# EAGLE design Keyboard02 (EAGLE 5.00)
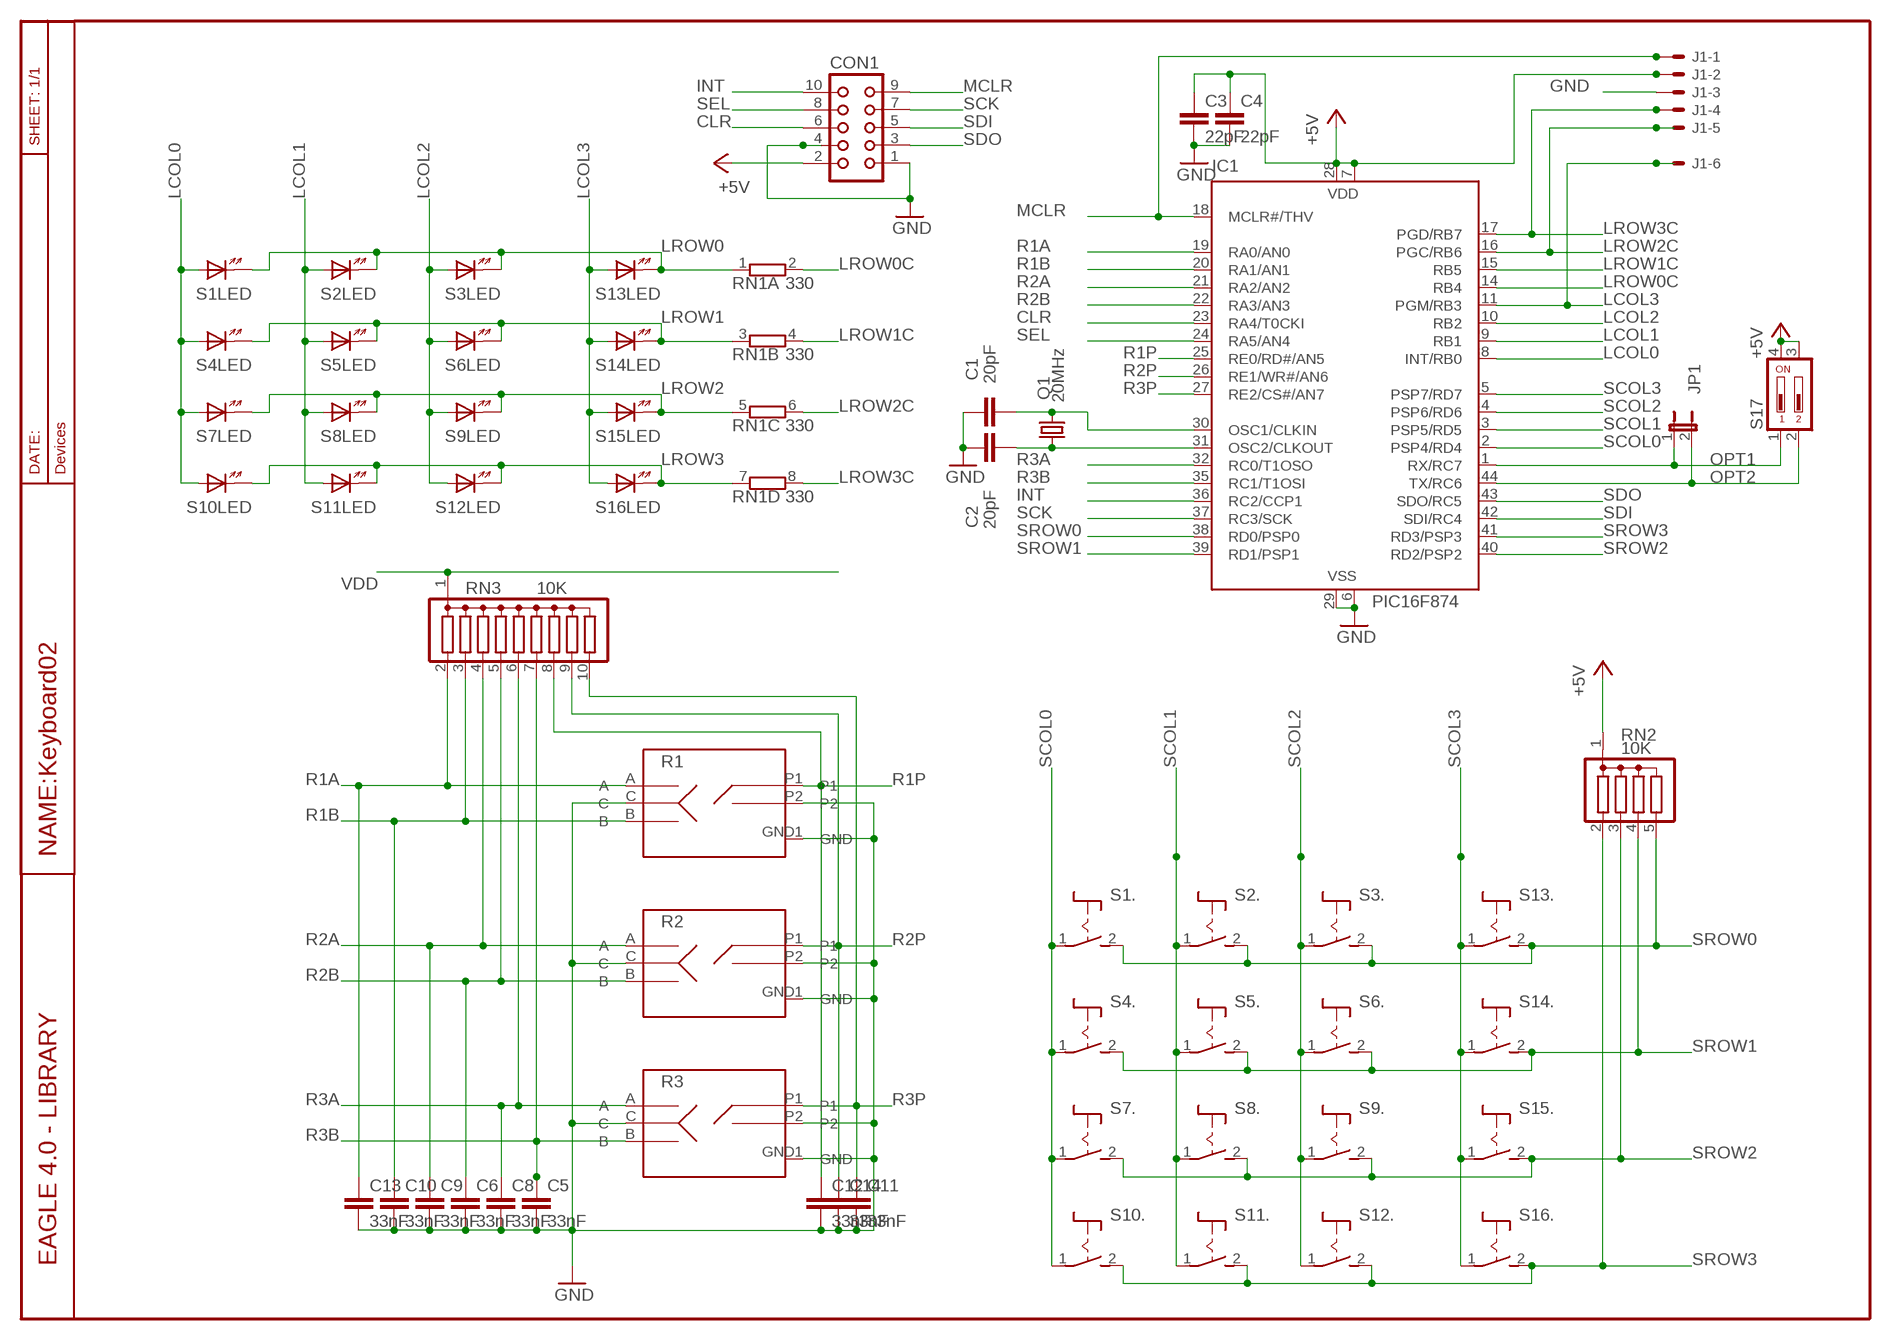
[diagram p0: schematic, sheet 1]

## Parts
C1  20pF  C-EUC0805K  [C0805K]
C2  20pF  C-EUC0805K  [C0805K]
C3  22pF  C-EUC0805K  [C0805K]
C4  22pF  C-EUC0805K  [C0805K]
C5  33nF  C-EUC0805K  [C0805K]
C6  33nF  C-EUC0805K  [C0805K]
C8  33nF  C-EUC0805K  [C0805K]
C9  33nF  C-EUC0805K  [C0805K]
C10  33nF  C-EUC0805K  [C0805K]
C11  33nF  C-EUC0805K  [C0805K]
C12  33nF  C-EUC0805K  [C0805K]
C13  33nF  C-EUC0805K  [C0805K]
C14  33nF  C-EUC0805K  [C0805K]
CON1  CON10L  [CON10L]
IC1  PIC16F874  PIC16F874PQ  [MQFP44-2]
J1  22-27-2061-06  [6410-06]
JP1  JP1E  [JP1]
Q1  20MHz  CRYTALMM20SS  [MM20SS]
R1  DDM_427  [DDM427]
R2  DDM_427  [DDM427]
R3  DDM_427  [DDM427]
RN1  330  E5R  [SIL10]
RN2  10K  G04R  [SIL5]
RN3  10K  G09R  [SIL10]
S1  MARQ6425BS  [MARQ6425-BS]
S2  MARQ6425BS  [MARQ6425-BS]
S3  MARQ6425BS  [MARQ6425-BS]
S4  MARQ6425BS  [MARQ6425-BS]
S5  MARQ6425BS  [MARQ6425-BS]
S6  MARQ6425BS  [MARQ6425-BS]
S7  MARQ6425BS  [MARQ6425-BS]
S8  MARQ6425BS  [MARQ6425-BS]
S9  MARQ6425BS  [MARQ6425-BS]
S10  MARQ6425BS  [MARQ6425-BS]
S11  MARQ6425BS  [MARQ6425-BS]
S12  MARQ6425BS  [MARQ6425-BS]
S13  MARQ6425BS  [MARQ6425-BS]
S14  MARQ6425BS  [MARQ6425-BS]
S15  MARQ6425BS  [MARQ6425-BS]
S16  MARQ6425BS  [MARQ6425-BS]
S17  DA02  [DA-02]

## Nets
CLR: CON1.6 IC1.23(RA4/T0CKI)
GND [SUPPLY]: C1.1 C2.1 C3.2 C4.2 C5.2 C6.2 C8.2 C9.2 C10.2 C11.2 C12.2 C13.2 C14.2 CON1.1 CON1.4 IC1.6(VSS) IC1.29(VSS) J1.3 R1.C R1.GND1(GND) R1.P2 R2.C R2.GND1(GND) R2.P2 R3.C R3.GND1(GND) R3.P2
INT: CON1.10 IC1.36(RC2/CCP1)
LCOL0: IC1.8(INT/RB0) S1.A(LED:A) S4.A(LED:A) S7.A(LED:A) S10.A(LED:A)
LCOL1: IC1.9(RB1) S2.A(LED:A) S5.A(LED:A) S8.A(LED:A) S11.A(LED:A)
LCOL2: IC1.10(RB2) S3.A(LED:A) S6.A(LED:A) S9.A(LED:A) S12.A(LED:A)
LCOL3: IC1.11(PGM/RB3) J1.6 S13.A(LED:A) S14.A(LED:A) S15.A(LED:A) S16.A(LED:A)
LROW0: RN1.1 S1.K(LED:K) S2.K(LED:K) S3.K(LED:K) S13.K(LED:K)
LROW0C: IC1.14(RB4) RN1.2
LROW1: RN1.3 S4.K(LED:K) S5.K(LED:K) S6.K(LED:K) S14.K(LED:K)
LROW1C: IC1.15(RB5) RN1.4
LROW2: RN1.5 S7.K(LED:K) S8.K(LED:K) S9.K(LED:K) S15.K(LED:K)
LROW2C: IC1.16(PGC/RB6) J1.5 RN1.6
LROW3: RN1.7 S10.K(LED:K) S11.K(LED:K) S12.K(LED:K) S16.K(LED:K)
LROW3C: IC1.17(PGD/RB7) J1.4 RN1.8
MCLR: CON1.9 IC1.18(MCLR#/THV) J1.1
OPT1: IC1.1(RX/RC7) JP1.1 S17.1
OPT2: IC1.44(TX/RC6) JP1.2 S17.2
OSC1: C1.2 IC1.30(OSC1/CLKIN) Q1.1
OSC2: C2.2 IC1.31(OSC2/CLKOUT) Q1.4
R1A: C13.1 IC1.19(RA0/AN0) R1.A RN3.2
R1B: C10.1 IC1.20(RA1/AN1) R1.B RN3.3
R1P: C12.1 IC1.25(RE0/RD#/AN5) R1.P1 RN3.8
R2A: C9.1 IC1.21(RA2/AN2) R2.A RN3.4
R2B: C6.1 IC1.22(RA3/AN3) R2.B RN3.5
R2P: C14.1 IC1.26(RE1/WR#/AN6) R2.P1 RN3.9
R3A: C8.1 IC1.32(RC0/T1OSO) R3.A RN3.6
R3B: C5.1 IC1.35(RC1/T1OSI) R3.B RN3.7
R3P: C11.1 IC1.27(RE2/CS#/AN7) R3.P1 RN3.10
SCK: CON1.7 IC1.37(RC3/SCK)
SCOL0: IC1.2(PSP4/RD4) S1.1(.:P) S4.1(.:P) S7.1(.:P) S10.1(.:P)
SCOL1: IC1.3(PSP5/RD5) S2.1(.:P) S5.1(.:P) S8.1(.:P) S11.1(.:P)
SCOL2: IC1.4(PSP6/RD6) S3.1(.:P) S6.1(.:P) S9.1(.:P) S12.1(.:P)
SCOL3: IC1.5(PSP7/RD7) S13.1(.:P) S14.1(.:P) S15.1(.:P) S16.1(.:P)
SDI: CON1.5 IC1.42(SDI/RC4)
SDO: CON1.3 IC1.43(SDO/RC5)
SEL: CON1.8 IC1.24(RA5/AN4)
SROW0: IC1.38(RD0/PSP0) RN2.5 S1.2(.:S) S2.2(.:S) S3.2(.:S) S13.2(.:S)
SROW1: IC1.39(RD1/PSP1) RN2.4 S4.2(.:S) S5.2(.:S) S6.2(.:S) S14.2(.:S)
SROW2: IC1.40(RD2/PSP2) RN2.3 S7.2(.:S) S8.2(.:S) S9.2(.:S) S15.2(.:S)
SROW3: IC1.41(RD3/PSP3) RN2.2 S10.2(.:S) S11.2(.:S) S12.2(.:S) S16.2(.:S)
VDD [SUPPLY]: C3.1 C4.1 CON1.2 IC1.7(VDD) IC1.28(VDD) J1.2 RN2.1 RN3.1 S17.3 S17.4 ; supply symbol labelled +5V
Unconnected: RN1.9 RN1.10

## Library data of the parts
C1-C6 C8-C14 = rcl:C-EU: CAPACITOR, European symbol
CON1 = con-harting:CON10L: CONNECTOR
IC1 = microchip:PIC16F87*: MICROCONTROLLER
J1 = ep_molex_6410_7395-02:22-?-06: CONNECTOR wire to board 2.54 mm (.1 inch) pitch header
JP1 = jumper:JP1E: JUMPER
Q1 = crystal:CRYTAL: CRYSTAL
R1-R3 = turbod3:DDM_427
RN1 = resistor-sil:E5R: SIL RESISTOR
RN2 = resistor-sil:G04R: SIL RESISTOR
RN3 = resistor-sil:G09R: SIL RESISTOR
S1-S16 = switch:MARQ6425: DIL SWITCH with LED, Marquardt
S17 = switch-dil:DA02: DIL/CODE SWITCH

## Net classes
0 default: width 0.254 mm, clearance 0.254 mm
1 SUPPLY: width 0.356 mm, clearance 0.254 mm

## Board
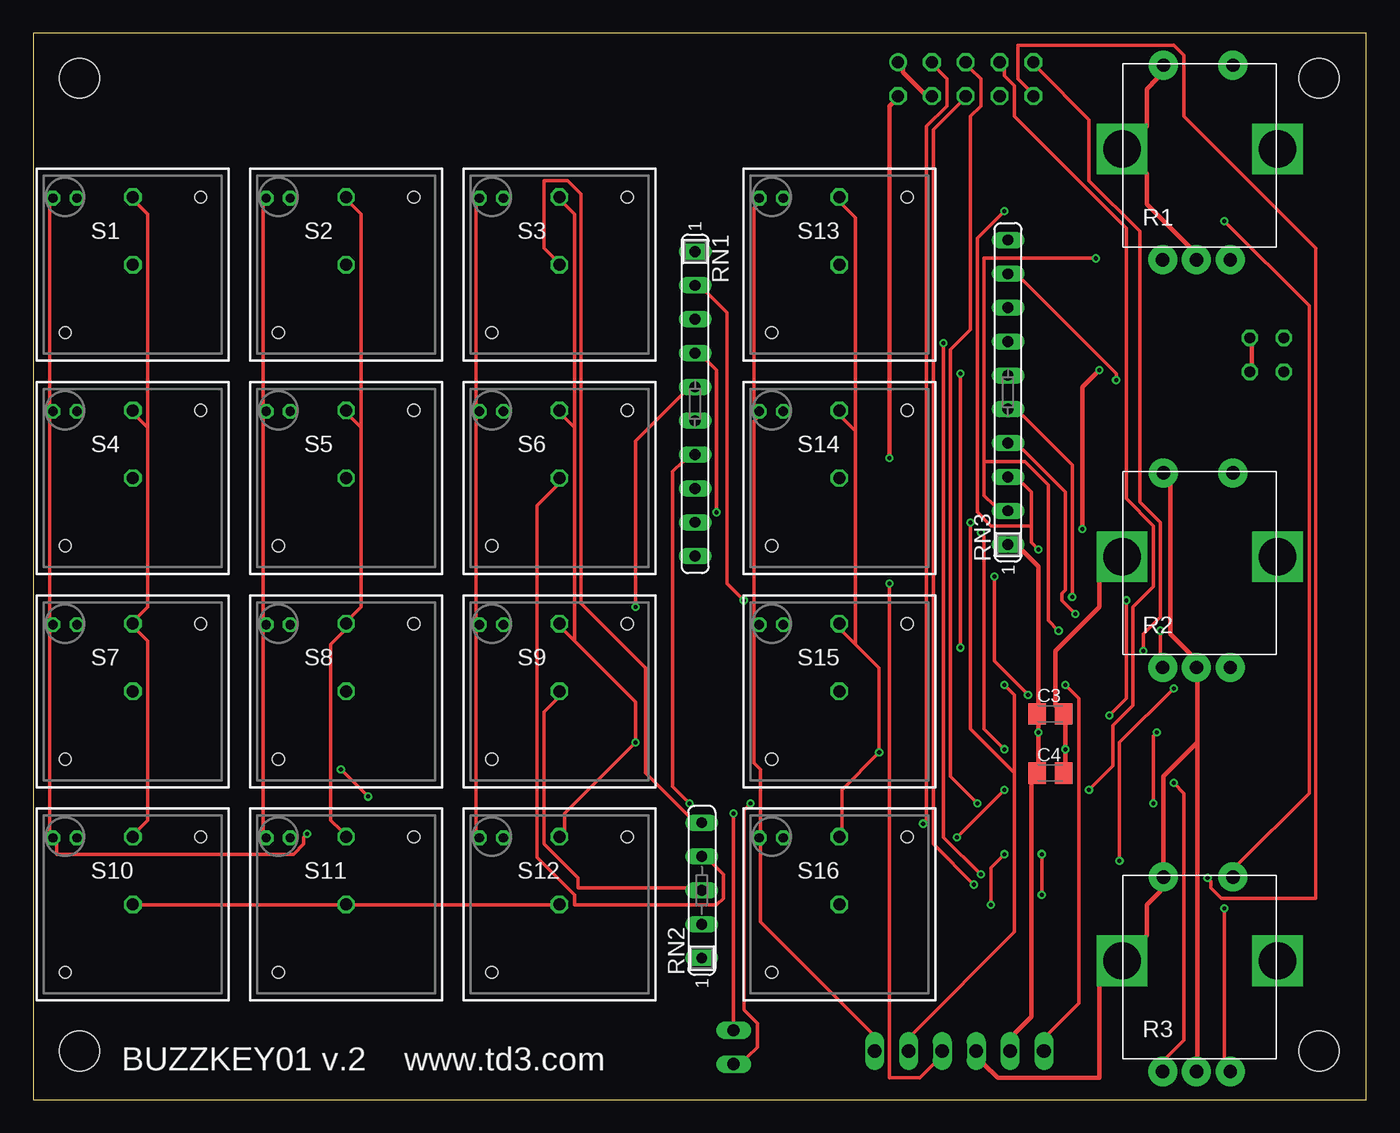
[diagram p1: board, top side]
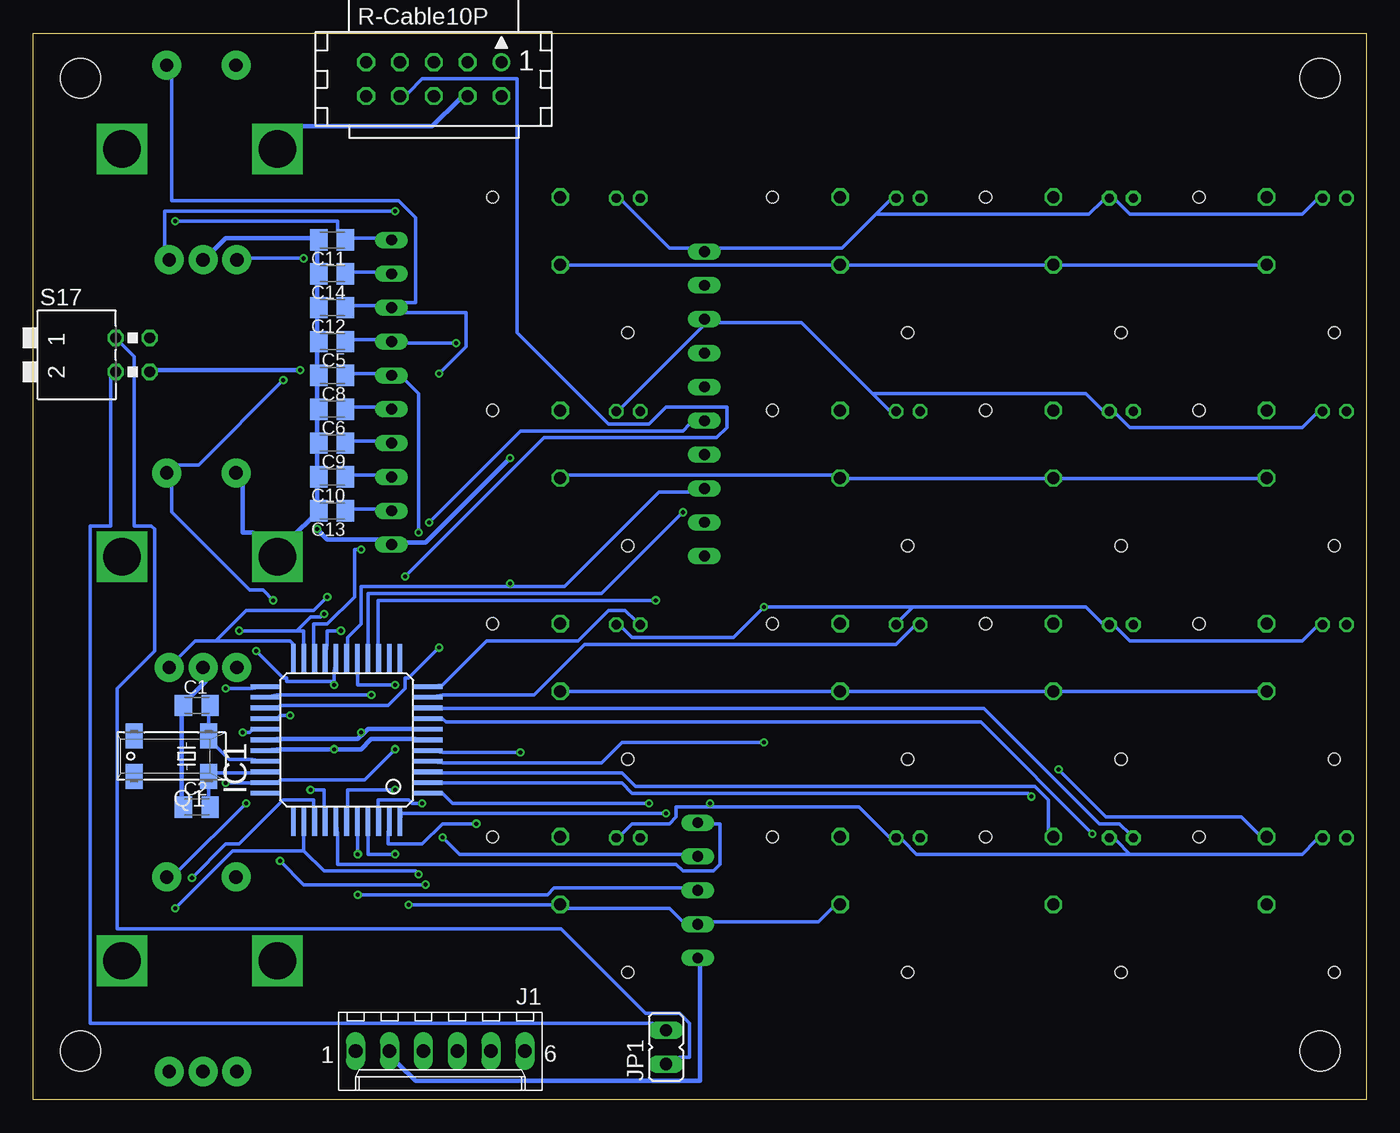
[diagram p2: board, bottom side, seen from below]

Size 100 x 80 mm. Coordinates in mm from the lower left corner, seen from the top.
Outline: 0,0 100,0 100,80 0,80 0,0
Copper layers (1*16): Top 0.035mm / dielectric 1.5mm / Bottom 0.035mm
Design rules "leiton": minimum track width 6mil, minimum drill 12mil, track to track 6mil, track to pad 6mil, pad to pad 6mil, via to via 6mil, smd to smd 6mil, copper to edge 20mil, drill to drill 8mil, minimum pad ring 8mil, minimum via ring 6mil, stop-mask expansion 3mil, vias tented up to drill 0mil, thermal gap 8mil
Holes 3 mm at 3.47,3.63 96.47,76.63 3.47,76.63 96.47,3.63

### Footprints (pad centres in the part's own frame; a part is rotated, then mirrored left to right if it is on the bottom)
C0805K = smd 1.3 x 1.6: 1 -1,0; 2 1,0
CON10L = drill 0.914 round: 1 5.08,1.27 | drill 0.914 octagon: 2 5.08,-1.27; 3 2.54,1.27; 4 2.54,-1.27; 5 0,1.27; 6 0,-1.27; 7 -2.54,1.27; 8 -2.54,-1.27; 9 -5.08,1.27; 10 -5.08,-1.27
MQFP44-2 = smd 0.35 x 2.2: 1 -4,-6.1; 2 -3.2,-6.1; 3 -2.4,-6.1; 4 -1.6,-6.1; 5 -0.8,-6.1; 6 0,-6.1; 7 0.8,-6.1; 8 1.6,-6.1; 9 2.4,-6.1; 10 3.2,-6.1; 11 4,-6.1; 23 4,6.1; 24 3.2,6.1; 25 2.4,6.1; 26 1.6,6.1; 27 0.8,6.1; 28 0,6.1; 29 -0.8,6.1; 30 -1.6,6.1; 31 -2.4,6.1; 32 -3.2,6.1; 33 -4,6.1 | smd 2.2 x 0.35: 12 6.1,-4; 13 6.1,-3.2; 14 6.1,-2.4; 15 6.1,-1.6; 16 6.1,-0.8; 17 6.1,0; 18 6.1,0.8; 19 6.1,1.6; 20 6.1,2.4; 21 6.1,3.2; 22 6.1,4; 34 -6.1,4; 35 -6.1,3.2; 36 -6.1,2.4; 37 -6.1,1.6; 38 -6.1,0.8; 39 -6.1,0; 40 -6.1,-0.8; 41 -6.1,-1.6; 42 -6.1,-2.4; 43 -6.1,-3.2; 44 -6.1,-4
6410-06 = drill 1.016 long: 1 6.35,0; 2 3.81,0; 3 1.27,0; 4 -1.27,0; 5 -3.81,0; 6 -6.35,0
JP1 = drill 0.914 long: 1 0,-1.27; 2 0,1.27
MM20SS = smd 1.27 x 1.88: 1 -2.794,-1.524; 2 2.794,-1.524; 3 2.794,1.524; 4 -2.794,1.524
DDM427 = drill 1 pad 2.184 round: A 2.98,-0.96; B 8.06,-0.96; C 5.52,-0.96; P1 8.25,13.64; P2 3.04,13.64 | drill 2.8 pad 3.81 square: GND1 -0.06,7.35; GND2 11.6,7.35
SIL10 = drill 0.813 long: 1 -11.43,0; 2 -8.89,0; 3 -6.35,0; 4 -3.81,0; 5 -1.27,0; 6 1.27,0; 7 3.81,0; 8 6.35,0; 9 8.89,0; 10 11.43,0
SIL5 = drill 0.813 long: 1 -5.08,0; 2 -2.54,0; 3 0,0; 4 2.54,0; 5 5.08,0
MARQ6425-BS = drill 0.9 octagon: 1 0,5.08; 2 0,0 | drill 0.7 octagon: A -6,5; K -4.2,5 | hole 0.9: 5.08,5.08; -5.08,-5.08
DA-02 = drill 0.813 octagon: 1 -1.27,-1.27; 2 1.27,-1.27; 3 1.27,1.27; 4 -1.27,1.27

### Placement (x,y rotation side)
C1  87.73,29.57 0 bottom
C2  87.73,21.95 0 bottom
C3  76.3,28.93 0 top
C4  76.3,24.49 0 top
C5  77.58,56.88 180 bottom
C6  77.58,51.8 180 bottom
C8  77.58,54.34 180 bottom
C9  77.58,49.26 180 bottom
C10  77.58,46.72 180 bottom
C11  77.58,64.5 180 bottom
C12  77.58,59.41 180 bottom
C13  77.58,44.18 180 bottom
C14  77.58,61.96 180 bottom
CON1  69.95,76.56 0 bottom
IC1  76.5,26.98 90 bottom
J1  69.47,3.63 180 bottom
JP1  52.54,3.93 0 bottom
Q1  89.64,25.76 180 bottom
R1  81.75,63.97 0 top
R2  81.75,33.38 0 top
R3  81.75,3.06 0 top
RN1  49.66,52.2 270 top
RN2  50.16,15.7 90 top
RN3  73.13,53.07 90 top
S1  7.47,62.63 0 top
S2  23.47,62.63 0 top
S3  39.47,62.63 0 top
S4  7.47,46.63 0 top
S5  23.47,46.63 0 top
S6  39.47,46.63 0 top
S7  7.47,30.63 0 top
S8  23.47,30.63 0 top
S9  39.47,30.63 0 top
S10  7.47,14.63 0 top
S11  23.47,14.63 0 top
S12  39.47,14.63 0 top
S13  60.47,62.63 0 top
S14  60.47,46.63 0 top
S15  60.47,30.63 0 top
S16  60.47,14.63 0 top
S17  92.55,55.88 270 bottom

### Tracks (layer width: path | path; a pad name or v marks a point on that pad's centre or on a via)
CLR  (via drill 0.3)
  Top 0.254: v85.56,30.86 81.5,26.79 v81.5,17.9 | v70.57,16.12 67.53,19.17 67.53,72.77 69.56,74.8 CON1.6
  Bottom 0.254: v85.56,30.86 83.53,30.86 IC1.23 | v81.5,17.9 79.72,16.12 v70.57,16.12
GND  (via drill 0.3)
  Top 0.356: J1.3 71.34,2.66 72.35,1.65 79.97,1.65 79.97,8.76 R3.GND1 83.53,12.31 83.53,14.6 84.54,15.62 R3.P2 84.8,17.65 84.8,24.25 87.34,26.79 | 87.34,26.79 87.34,31.36 R2.C 86.83,33.4 85.31,34.92 85.31,46.1 R2.P2 | 87.34,26.79 87.34,3.17 R3.C | CON1.4 66.76,75.56 65.24,77.08 65.24,77.34 CON1.1 | R1.C 86.83,63.88 83.53,67.18 83.53,69.46 R1.GND1 83.53,73.02 83.53,75.81 84.29,76.58 R1.P2 | C4.2 77.43,25.27 v77.43,26.28 77.43,28.32 C3.2 76.67,29.59 76.67,33.65 79.97,36.95 79.97,38.98 R2.GND1
  Bottom 0.356: C2.1 88.86,22.73 88.86,28.82 C1.1 88.1,30.35 87.08,31.36 R2.C | CON1.4 68.03,75.05 70.07,73.02 79.97,73.02 R1.GND1 | IC1.6 71.34,27.05 74.64,27.05 75.4,26.28 v77.43,26.28 81.75,26.28 IC1.29 | R2.P2 84.29,46.1 84.29,42.54 83.53,42.54 R2.GND1 80.23,42.54 79.21,43.56 C13.2 78.7,44.83 78.7,46.1 C10.2 78.7,47.37 78.7,48.64 C9.2 78.7,49.91 78.7,51.18 C6.2 78.7,52.45 78.7,53.72 C8.2 78.7,54.99 78.7,56.26 C5.2 78.7,57.53 78.7,58.8 C12.2 78.7,60.07 78.7,61.34 C14.2 78.7,62.61 78.7,63.88 C11.2 79.21,64.64 85.56,64.64 86.58,63.62 R1.C
INT  (via drill 0.3)
  Top 0.254: v88.1,16.63 88.35,16.38 88.35,15.87 89.12,15.11 96.23,15.11 96.23,63.88 86.32,73.78 86.32,78.35 85.56,79.12 73.88,79.12 73.88,76.58 74.64,75.81 CON1.10
  Bottom 0.254: v88.1,16.63 85.56,19.17 84.54,19.17 81.24,22.47 78.96,22.47 78.96,21.97 IC1.36
LCOL0  (via drill 0.3)
  Top 0.254: S1.A 1.23,67.18 1.23,51.94 S4.A 1.23,51.18 1.23,35.94 S7.A 1.23,35.17 1.23,19.93 S10.A 1.74,19.17 1.74,18.41 19.52,18.41 20.28,19.17 20.28,19.68 v20.54,19.93
  Bottom 0.254: v20.54,19.93 28.92,28.32 69.05,28.32 69.3,28.57 IC1.8
LCOL1
  Top 0.254: S2.A 17.23,67.18 17.23,51.94 S5.A 17.23,51.18 17.23,35.94 S8.A 17.23,35.17 17.23,19.93 S11.A
  Bottom 0.254: IC1.9 69.3,29.33 28.66,29.33 20.03,20.7 18.5,20.7 17.74,19.93 S11.A
LCOL2
  Top 0.254: S3.A 33.24,67.18 33.24,51.94 S6.A 33.24,51.18 33.24,35.94 S9.A 33.24,35.17 33.24,19.93 S12.A
  Bottom 0.254: IC1.10 69.3,30.35 62.45,30.35 58.64,34.16 35.27,34.16 34,35.43 S9.A
LCOL3
  Top 0.254: S13.A 54.32,67.18 54.06,66.92 54.06,51.94 S14.A 54.32,51.18 54.06,50.92 54.06,35.94 S15.A 54.06,35.43 54.06,25.27 54.57,24.76 54.57,19.93 S16.A 54.57,19.17 54.57,13.33 62.95,4.95 J1.6
  Bottom 0.254: IC1.11 69.3,31.11 66,34.41 59.14,34.41 56.86,36.7 55.59,36.7 54.83,35.94 S15.A
LROW0
  Bottom 0.254: S1.K 3.77,67.43 4.79,66.42 17.74,66.42 18.76,67.43 S2.K 19.77,67.43 20.79,66.42 36.79,66.42 | 36.79,66.42 39.33,63.88 48.48,63.88 RN1.1 50.76,63.88 52.29,63.88 55.84,67.43 S13.K | 36.79,66.42 35.78,67.43 S3.K
LROW0C  (via drill 0.3)
  Top 0.254: v53.3,37.46 52.03,38.73 52.03,59.05 50.51,60.57 RN1.2
  Bottom 0.254: v53.3,37.46 74.13,37.46 74.13,34.16 IC1.14
LROW1
  Bottom 0.254: S4.K 3.77,51.43 4.79,50.41 17.74,50.41 18.76,51.43 S5.K 19.77,51.68 21.04,52.95 37.05,52.95 | 37.05,52.95 42.38,58.29 48.48,58.29 RN1.3 49.75,58.03 55.84,51.94 S14.K | 37.05,52.95 35.78,51.68 S6.K
LROW1C  (via drill 0.3)
  Top 0.254: v51.27,44.06 51.27,54.73 50.51,55.49 RN1.4
  Bottom 0.254: v51.27,44.06 57.37,37.97 74.89,37.97 74.89,34.16 IC1.15
LROW2  (via drill 0.3)
  Top 0.254: v45.17,36.95 45.17,49.4 48.73,52.95 RN1.5
  Bottom 0.254: S7.K 3.77,35.43 4.79,34.41 17.74,34.41 18.76,35.43 S8.K 19.77,35.68 21.04,36.95 34,36.95 | 34,36.95 35.01,35.94 S9.K | 34,36.95 v45.17,36.95 47.46,34.67 55.08,34.67 55.84,35.43 S15.K
LROW2C  (via drill 0.3)
  Top 0.254: v72.86,31.11 73.62,30.35 73.62,24.51 | 73.62,24.51 73.62,12.57 66,4.95 J1.5 | v70.32,43.3 70.32,27.81 73.62,24.51
  Bottom 0.254: v72.86,31.11 75.65,31.11 75.65,32.13 IC1.16 | v70.32,43.3 63.46,50.16 51.27,50.16 50.76,50.67 RN1.6
LROW3  (via drill 0.3)
  Top 0.254: v49.24,22.22 47.97,23.49 47.97,47.11 48.73,47.87 RN1.7
  Bottom 0.254: 17.74,18.41 4.79,18.41 3.77,19.43 S10.K | 17.74,18.41 18.76,19.43 S11.K | 17.74,18.41 33.74,18.41 34.76,19.43 S12.K 35.78,19.68 38.06,21.97 49.24,21.97 | 49.24,21.97 51.78,21.97 51.78,21.2 52.29,20.7 55.08,20.7 55.84,19.93 S16.K | 49.24,21.97 v49.24,22.22
LROW3C  (via drill 0.3)
  Top 0.254: v64.22,38.73 64.22,1.65 66.51,1.65 67.53,2.66 J1.4
  Bottom 0.254: 64.22,38.48 60.16,38.48 53.05,45.59 50.76,45.59 RN1.8 | 64.22,38.48 75.4,38.48 75.4,35.68 76.42,34.67 76.42,34.16 IC1.17 | v64.22,38.73 64.22,38.48
MCLR  (via drill 0.3)
  Top 0.254: v77.43,31.11 78.45,30.09 78.45,7.23 76.16,4.95 J1.1 | v83.27,33.65 83.27,34.92 84.54,36.19 84.54,43.3 83.02,44.83 83.02,65.15 79.21,68.96 79.21,73.53 75.4,77.34 CON1.9
  Bottom 0.254: 77.43,31.36 77.43,32.13 IC1.18 | v83.27,33.65 81.24,31.62 80.99,31.62 80.99,31.36 77.43,31.36 | v77.43,31.11 77.43,31.36
OPT1  (via drill 0.3)
  Top 0.254: v53.81,22.22 53.3,21.71 53.3,6.73 54.32,5.71 54.32,3.93 53.56,3.17 JP1.1
  Bottom 0.254: v53.81,22.22 68.54,22.22 69.3,22.98 IC1.1 | S17.1 92.42,55.75 92.42,43.05 91.15,43.05 90.89,42.79 90.89,33.65 93.69,30.86 93.69,12.82 60.41,12.82 54.06,6.47 51.52,6.47 50.76,5.71 50.76,3.17 51.52,3.17 JP1.1
OPT2  (via drill 0.3)
  Top 0.254: JP1.2 v52.54,21.46
  Bottom 0.254: v52.54,21.46 72.35,21.46 IC1.44 | S17.2 94.2,54.22 94.2,43.05 95.72,43.05 95.72,5.71 53.56,5.71 JP1.2
OSC1
  Bottom 0.254: C1.2 86.83,28.82 86.83,28.06 Q1.1 86.32,26.54 85.31,25.52 83.53,25.52 IC1.30
OSC2
  Bottom 0.254: C2.2 86.83,22.73 86.83,23.49 Q1.4 86.32,24.51 83.53,24.51 IC1.31
R1A  (via drill 0.3)
  Top 0.254: v76.92,35.17 76.16,35.94 76.16,46.1 74.38,47.87 71.34,47.87 | 71.34,47.87 71.34,45.33 72.1,44.57 RN3.2 | v79.72,63.11 71.34,63.11 71.34,47.87
  Bottom 0.254: C13.1 76.16,44.32 74.13,44.32 RN3.2 | v76.92,35.17 77.94,35.17 77.94,34.16 IC1.19 | v79.72,63.11 83.78,63.11 R1.A
R1B  (via drill 0.3)
  Top 0.254: v75.4,41.27 74.89,41.78 74.89,43.05 | 74.89,43.05 74.89,45.59 74.13,46.35 RN3.3 | v72.86,66.67 70.83,64.64 70.83,44.06 71.84,43.05 74.89,43.05
  Bottom 0.254: C10.1 76.16,46.86 74.13,46.86 RN3.3 | v75.4,41.27 75.91,41.27 75.91,37.71 77.94,35.68 78.96,35.68 78.96,34.16 IC1.20 | v72.86,66.67 90.13,66.67 90.13,63.88 R1.B
R1P  (via drill 0.3)
  Top 0.254: v69.56,33.9 v69.56,54.48
  Bottom 0.254: C12.1 76.16,59.56 74.13,59.56 RN3.8 | v69.56,33.9 71.84,31.62 72.1,31.62 72.1,30.86 73.37,29.59 81.5,29.59 81.75,29.33 IC1.25 | v69.56,54.48 67.53,56.51 67.53,59.05 72.1,59.05 RN3.8 | R1.P1 89.62,76.58 89.62,67.43 72.61,67.43 71.34,66.16 71.34,59.81 72.1,59.81 RN3.8
R2A  (via drill 0.3)
  Top 0.254: v84.54,35.17 84.54,33.4 R2.A | v78.19,36.44 77.18,37.46 77.18,37.97 77.43,38.22 77.43,45.59 74.13,48.89 RN3.4
  Bottom 0.254: C9.1 76.16,49.4 74.13,49.4 RN3.4 | 80.23,35.17 v84.54,35.17 | 80.23,35.17 79.72,35.17 79.72,34.16 IC1.21 | v78.19,36.44 78.45,36.19 79.21,36.19 80.23,35.17
R2B  (via drill 0.3)
  Top 0.254: v77.94,37.71 77.94,47.62 74.13,51.43 RN3.5
  Bottom 0.254: C6.1 76.16,51.94 74.13,51.94 RN3.5 | 86.32,34.41 87.85,34.41 89.12,33.14 R2.B | 86.32,34.41 80.73,34.41 80.48,34.16 IC1.22 | v77.94,37.71 78.96,36.7 84.04,36.7 86.32,34.41
R2P  (via drill 0.3)
  Top 0.254: v80.73,28.82 82,30.09 v82,37.46 | v81.24,53.97 81.24,54.48 74.13,61.59 RN3.9
  Bottom 0.254: C14.1 76.16,62.1 74.13,62.1 RN3.9 | v80.73,28.82 81.5,28.82 81.75,28.57 IC1.26 | v82,37.46 82.77,38.22 83.78,38.22 89.62,44.06 89.62,46.1 R2.P1 89.12,47.62 87.59,47.62 v81.24,53.97
R3A  (via drill 0.3)
  Top 0.254: v85.56,23.74 86.32,22.98 86.32,4.44 85.05,3.17 R3.A | v71.08,42.54 71.34,42.29 71.34,27.81 v72.86,26.28
  Bottom 0.254: C8.1 76.16,54.48 74.13,54.48 RN3.6 72.1,53.97 71.08,52.95 v71.08,42.54 | v85.56,23.74 83.53,23.74 IC1.32 81.75,23.74 81.5,24 75.15,24 v72.86,26.28
R3B  (via drill 0.3)
  Top 0.254: v89.37,14.35 89.37,3.17 R3.B | v68.29,56.76 68.29,19.68 v71.08,16.89
  Bottom 0.254: C5.1 76.16,57.02 74.13,57.02 RN3.7 72.1,56.76 v68.29,56.76 | 79.72,18.66 79.72,19.93 IC1.35 | 79.72,18.66 85.05,18.66 v89.37,14.35 | v71.08,16.89 71.34,17.14 78.19,17.14 79.72,18.66
R3P  (via drill 0.3)
  Top 0.254: v84.29,27.55 84.04,27.3 v84.04,22.22 | v89.37,65.91 95.72,59.56 95.72,22.98 90.39,17.65 R3.P1
  Bottom 0.254: RN3.10 74.13,64.64 76.16,64.64 C11.1 77.18,65.15 77.18,65.91 v89.37,65.91 | v84.29,27.55 83.78,27.55 83.53,27.81 IC1.27 | v84.04,22.22 89.12,17.14 R3.P1
SCK  (via drill 0.3)
  Top 0.254: v79.21,23.24 80.99,25.01 80.99,28.06 82.51,29.59 82.51,36.95 84.04,38.48 84.04,43.05 82,45.08 82,65.4 73.62,73.78 73.62,76.07 72.86,76.83 72.86,77.34 CON1.7
  Bottom 0.254: v79.21,23.24 78.19,23.24 78.19,21.97 IC1.37
SCOL0  (via drill 0.3)
  Top 0.254: 8.6,50.41 8.6,36.95 7.84,36.19 S7.1 7.84,35.17 8.6,34.41 8.6,20.95 7.84,20.19 S10.1 | 8.6,50.41 7.84,51.18 S4.1 | 8.6,50.41 8.6,66.42 7.84,67.18 S1.1 | v23.08,24.76 v25.11,22.73
  Bottom 0.254: v25.11,22.73 25.36,22.98 55.08,22.98 55.84,23.74 69.3,23.74 IC1.2 | v23.08,24.76 19.52,21.2 9.36,21.2 8.09,19.93 S10.1
SCOL1
  Top 0.254: 24.6,50.41 24.6,36.95 23.84,36.19 S8.1 23.33,35.17 22.31,34.16 22.31,20.95 23.08,20.19 S11.1 | 24.6,50.41 23.84,51.18 S5.1 | 24.6,50.41 24.6,66.42 23.84,67.18 S2.1
  Bottom 0.254: IC1.3 69.3,24.51 55.84,24.51 54.83,23.49 24.85,23.49 23.84,22.47 23.84,20.19 S11.1
SCOL2  (via drill 0.3)
  Top 0.254: S12.1 39.84,20.19 39.84,21.46 v45.17,26.79 45.17,29.84 40.6,34.41 | 40.6,34.41 39.84,35.17 S9.1 | 40.6,50.41 39.84,51.18 S6.1 | 40.6,34.41 40.6,50.41 | 40.6,50.41 40.6,66.42 39.84,67.18 S3.1
  Bottom 0.254: v45.17,26.79 55.84,26.79 57.37,25.27 69.3,25.27 IC1.4
SCOL3  (via drill 0.3)
  Top 0.254: S16.1 60.67,20.19 60.67,23.24 v63.46,26.03 63.46,32.38 61.68,34.16 | 61.68,34.16 60.67,35.17 S15.1 | 61.68,50.16 60.67,51.18 S14.1 | 61.68,34.16 61.68,50.16 | 61.68,50.16 61.68,66.16 60.67,67.18 S13.1
  Bottom 0.254: v63.46,26.03 69.3,26.03 IC1.5
SDI  (via drill 0.3)
  Top 0.254: v70.83,22.22 68.8,24.25 68.8,56.26 70.32,57.78 70.32,73.78 71.08,74.54 71.08,76.58 70.32,77.34 CON1.5
  Bottom 0.254: v70.83,22.22 71.59,22.22 71.84,22.47 74.13,22.47 74.13,21.97 IC1.42
SDO  (via drill 0.3)
  Top 0.254: v66.76,20.7 67.02,20.95 67.02,73.02 68.54,74.54 68.54,76.58 67.78,77.34 CON1.3
  Bottom 0.254: v66.76,20.7 69.3,20.7 70.83,19.17 73.37,19.17 73.37,19.93 IC1.43
SEL  (via drill 0.3)
  Top 0.254: v74.64,30.35 72.1,32.89 v72.1,39.24
  Bottom 0.254: v74.64,30.35 81.75,30.35 IC1.24 | v72.1,39.24 61.68,49.65 48.73,49.65 47.97,50.41 47.97,51.94 52.54,51.94 53.81,50.67 56.86,50.67 63.72,57.53 63.72,76.58 70.83,76.58 71.84,75.56 CON1.8
SROW0
  Top 0.254: RN2.5 49.24,21.2 45.94,24.51 45.94,32.38 41.11,37.21 41.11,67.94 40.09,68.96 38.32,68.96 38.32,63.88 39.08,63.11 S3.2
  Bottom 0.254: IC1.38 77.18,19.93 77.18,17.65 51.78,17.65 51.27,17.14 48.98,17.14 48.48,17.65 48.48,20.7 48.98,20.7 RN2.5 | S1.2 8.09,62.61 22.82,62.61 S2.2 24.09,62.61 38.82,62.61 S3.2 40.09,62.61 59.91,62.61 S13.2
SROW1  (via drill 0.3)
  Top 0.254: v69.3,19.68 v72.86,23.24 | RN2.4 51.02,17.65 51.78,16.89 51.78,15.11 51.27,14.6 40.6,14.6 40.6,15.36 37.81,18.16 37.81,44.57 39.33,46.1 S6.2
  Bottom 0.254: v72.86,23.24 76.42,23.24 76.42,21.97 IC1.39 | v69.3,19.68 68.03,18.41 51.27,18.41 RN2.4 | S4.2 8.09,46.6 22.82,46.6 S5.2 24.09,46.6 38.82,46.6 S6.2 40.09,46.86 59.91,46.86 S14.2
SROW2  (via drill 0.3)
  Top 0.254: v75.65,15.36 v75.65,18.41 | RN2.3 48.98,15.87 40.86,15.87 40.86,16.63 38.32,19.17 38.32,29.08 39.33,30.09 S9.2
  Bottom 0.254: v75.65,18.41 75.65,19.93 IC1.40 | v75.65,15.36 61.43,15.36 60.92,15.87 51.27,15.87 RN2.3 | S7.2 8.09,30.6 22.82,30.6 S8.2 24.09,30.6 38.82,30.6 S9.2 40.09,30.6 59.91,30.6 S15.2
SROW3  (via drill 0.3)
  Top 0.254: S10.2 8.09,14.6 22.82,14.6 S11.2 24.09,14.6 38.82,14.6 S12.2 | v72.86,18.41 71.84,17.39 v71.84,14.6
  Bottom 0.254: v72.86,18.41 74.89,18.41 74.89,19.93 IC1.41 | v71.84,14.6 60.92,14.6 S16.2 59.91,14.35 52.29,14.35 51.27,13.33 RN2.2 48.98,13.33 41.11,13.33 40.09,14.35 S12.2
VDD  (via drill 0.3)
  Top 0.356: S17.3 91.4,54.99 91.4,56.76 S17.4 | RN3.1 74.13,41.27 75.4,40 75.4,29.59 C3.1 75.4,28.32 v75.4,27.55 75.4,25.27 C4.1 74.89,23.74 74.89,6.22 73.62,4.95 J1.2 | v64.22,48.13 64.22,74.54 64.48,74.8 CON1.2 | v79.97,54.73 78.7,53.46 v78.7,42.79
  Bottom 0.356: RN2.1 50,10.03 50,1.39 71.34,1.39 72.61,2.66 J1.2 | 75.15,27.55 74.89,27.81 71.34,27.81 IC1.7 | 75.15,27.55 75.65,27.05 81.75,27.05 IC1.28 | v64.22,48.13 70.57,41.78 72.1,41.78 RN3.1 74.13,42.03 77.94,42.03 v78.7,42.79 | v79.97,54.73 90.89,54.73 S17.3 | v75.4,27.55 75.15,27.55

### Text on the board
tPlace: BUZZKEY01 v.2 www.td3.com